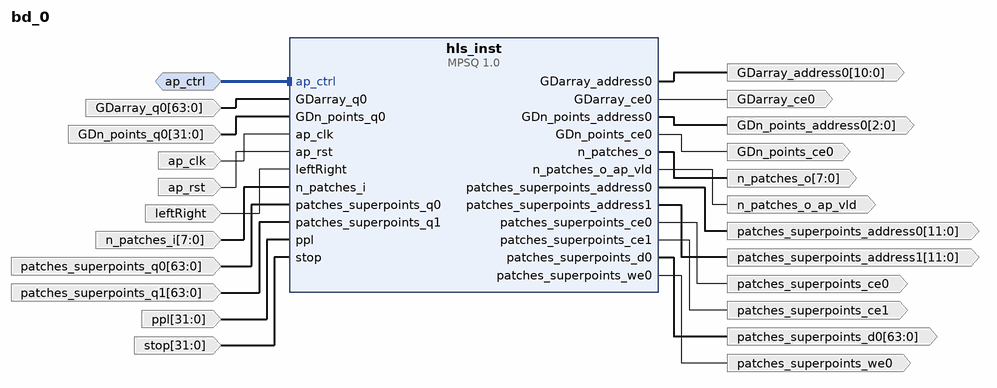
[diagram p0: block diagram of the top level]
# Vivado block design bd_0, xcvu19p-fsvb3824-2-e, Vivado 2020.2
create_bd_design bd_0

create_bd_intf_port -mode Slave -vlnv xilinx.com:interface:acc_handshake_rtl:1.0 ap_ctrl
create_bd_port -dir O -from 10 -to 0 -type data GDarray_address0
create_bd_port -dir O GDarray_ce0
create_bd_port -dir I -from 63 -to 0 -type data GDarray_q0
create_bd_port -dir O -from 2 -to 0 -type data GDn_points_address0
create_bd_port -dir O GDn_points_ce0
create_bd_port -dir I -from 31 -to 0 -type data GDn_points_q0
create_bd_port -dir I -type clk ap_clk
set_property -dict {CONFIG.FREQ_HZ 200000000.0} [get_bd_ports ap_clk]
create_bd_port -dir I -type rst ap_rst
set_property -dict {CONFIG.POLARITY ACTIVE_HIGH} [get_bd_ports ap_rst]
create_bd_port -dir I -type data leftRight
create_bd_port -dir I -from 7 -to 0 -type data n_patches_i
create_bd_port -dir O -from 7 -to 0 -type data n_patches_o
create_bd_port -dir O n_patches_o_ap_vld
create_bd_port -dir O -from 11 -to 0 -type data patches_superpoints_address0
create_bd_port -dir O -from 11 -to 0 -type data patches_superpoints_address1
create_bd_port -dir O patches_superpoints_ce0
create_bd_port -dir O patches_superpoints_ce1
create_bd_port -dir O -from 63 -to 0 -type data patches_superpoints_d0
create_bd_port -dir I -from 63 -to 0 -type data patches_superpoints_q0
create_bd_port -dir I -from 63 -to 0 -type data patches_superpoints_q1
create_bd_port -dir O patches_superpoints_we0
create_bd_port -dir I -from 31 -to 0 -type data ppl
create_bd_port -dir I -from 31 -to 0 -type data stop

create_bd_cell -type ip -vlnv xilinx.com:hls:MPSQ:1.0 hls_inst

# ---- connections ----

connect_bd_intf_net -intf_net ap_ctrl_0_1 [get_bd_intf_ports ap_ctrl] [get_bd_intf_pins hls_inst/ap_ctrl]
connect_bd_net [get_bd_pins hls_inst/GDarray_address0] [get_bd_ports GDarray_address0]
connect_bd_net [get_bd_pins hls_inst/GDarray_ce0] [get_bd_ports GDarray_ce0]
connect_bd_net -net GDarray_q0_0_1 [get_bd_ports GDarray_q0] [get_bd_pins hls_inst/GDarray_q0]
connect_bd_net [get_bd_pins hls_inst/GDn_points_address0] [get_bd_ports GDn_points_address0]
connect_bd_net [get_bd_pins hls_inst/GDn_points_ce0] [get_bd_ports GDn_points_ce0]
connect_bd_net -net GDn_points_q0_0_1 [get_bd_ports GDn_points_q0] [get_bd_pins hls_inst/GDn_points_q0]
connect_bd_net -net ap_clk_0_1 [get_bd_ports ap_clk] [get_bd_pins hls_inst/ap_clk]
connect_bd_net -net ap_rst_0_1 [get_bd_ports ap_rst] [get_bd_pins hls_inst/ap_rst]
connect_bd_net -net leftRight_0_1 [get_bd_ports leftRight] [get_bd_pins hls_inst/leftRight]
connect_bd_net -net n_patches_i_0_1 [get_bd_ports n_patches_i] [get_bd_pins hls_inst/n_patches_i]
connect_bd_net [get_bd_pins hls_inst/n_patches_o] [get_bd_ports n_patches_o]
connect_bd_net [get_bd_pins hls_inst/n_patches_o_ap_vld] [get_bd_ports n_patches_o_ap_vld]
connect_bd_net [get_bd_pins hls_inst/patches_superpoints_address0] [get_bd_ports patches_superpoints_address0]
connect_bd_net [get_bd_pins hls_inst/patches_superpoints_address1] [get_bd_ports patches_superpoints_address1]
connect_bd_net [get_bd_pins hls_inst/patches_superpoints_ce0] [get_bd_ports patches_superpoints_ce0]
connect_bd_net [get_bd_pins hls_inst/patches_superpoints_ce1] [get_bd_ports patches_superpoints_ce1]
connect_bd_net [get_bd_pins hls_inst/patches_superpoints_d0] [get_bd_ports patches_superpoints_d0]
connect_bd_net -net patches_superpoints_q0_0_1 [get_bd_ports patches_superpoints_q0] [get_bd_pins hls_inst/patches_superpoints_q0]
connect_bd_net -net patches_superpoints_q1_0_1 [get_bd_ports patches_superpoints_q1] [get_bd_pins hls_inst/patches_superpoints_q1]
connect_bd_net [get_bd_pins hls_inst/patches_superpoints_we0] [get_bd_ports patches_superpoints_we0]
connect_bd_net -net ppl_0_1 [get_bd_ports ppl] [get_bd_pins hls_inst/ppl]
connect_bd_net -net stop_0_1 [get_bd_ports stop] [get_bd_pins hls_inst/stop]

validate_bd_design
save_bd_design
